# Altium schematic sheet Potentiometers.SchDoc
size A4
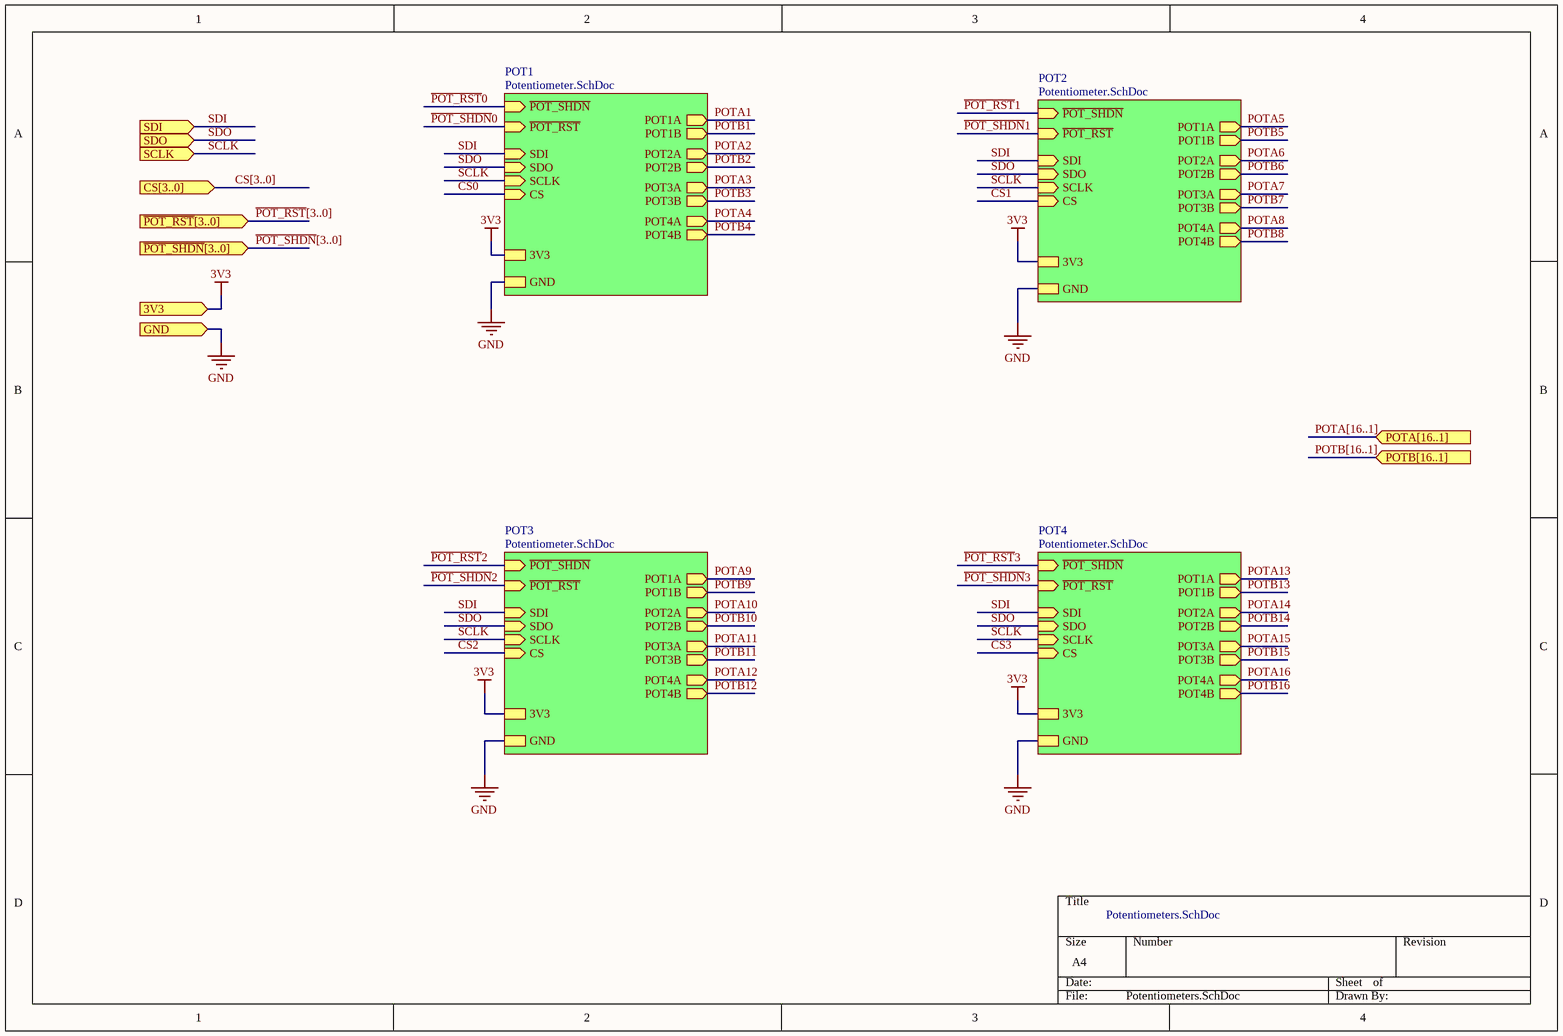
[diagram p0: Potentiometers.SchDoc]

## Sub-sheets
POT1 = Potentiometer.SchDoc: SDI (in), SCLK (in), CS (in), POT1A (out), POT1B (out), POT2A (out), POT2B (out), POT3A (out), POT3B (out), POT4A (out), POT4B (out), 3V3, GND, ~{POT_RST} (in), SDO (in), ~{POT_SHDN} (in)
POT2 = Potentiometer.SchDoc: SDI (in), SCLK (in), CS (in), POT1A (out), POT1B (out), POT2A (out), POT2B (out), POT3A (out), POT3B (out), POT4A (out), POT4B (out), 3V3, GND, ~{POT_RST} (in), SDO (in), ~{POT_SHDN} (in)
POT3 = Potentiometer.SchDoc: SDI (in), SCLK (in), CS (in), POT1A (out), POT1B (out), POT2A (out), POT2B (out), POT3A (out), POT3B (out), POT4A (out), POT4B (out), 3V3, GND, ~{POT_RST} (in), SDO (in), ~{POT_SHDN} (in)
POT4 = Potentiometer.SchDoc: SDI (in), SCLK (in), CS (in), POT1A (out), POT1B (out), POT2A (out), POT2B (out), POT3A (out), POT3B (out), POT4A (out), POT4B (out), 3V3, GND, ~{POT_RST} (in), SDO (in), ~{POT_SHDN} (in)

## Ports
3V3, CS[3..0] (in), GND, POTA[16..1] (in), POTB[16..1] (in), SCLK (in), SDI (in), SDO (in), ~{POT_RST}[3..0] (in), ~{POT_SHDN}[3..0] (in)

## Nets
3V3: port 3V3, sheet POT1/3V3, sheet POT2/3V3, sheet POT3/3V3, sheet POT4/3V3
GND: port GND, sheet POT1/GND, sheet POT2/GND, sheet POT3/GND, sheet POT4/GND
CS0: sheet POT1/CS
CS1: sheet POT2/CS
CS2: sheet POT3/CS
CS3: sheet POT4/CS
~{POT_RST}0: sheet POT1/~{POT_SHDN}
~{POT_RST}1: sheet POT2/~{POT_SHDN}
~{POT_RST}2: sheet POT3/~{POT_SHDN}
~{POT_RST}3: sheet POT4/~{POT_SHDN}
~{POT_SHDN}0: sheet POT1/~{POT_RST}
~{POT_SHDN}1: sheet POT2/~{POT_RST}
~{POT_SHDN}2: sheet POT3/~{POT_RST}
~{POT_SHDN}3: sheet POT4/~{POT_RST}
POTA1: sheet POT1/POT1A
POTA2: sheet POT1/POT2A
POTA3: sheet POT1/POT3A
POTA4: sheet POT1/POT4A
POTA5: sheet POT2/POT1A
POTA6: sheet POT2/POT2A
POTA7: sheet POT2/POT3A
POTA8: sheet POT2/POT4A
POTA9: sheet POT3/POT1A
POTA10: sheet POT3/POT2A
POTA11: sheet POT3/POT3A
POTA12: sheet POT3/POT4A
POTA13: sheet POT4/POT1A
POTA14: sheet POT4/POT2A
POTA15: sheet POT4/POT3A
POTA16: sheet POT4/POT4A
POTB1: sheet POT1/POT1B
POTB2: sheet POT1/POT2B
POTB3: sheet POT1/POT3B
POTB4: sheet POT1/POT4B
POTB5: sheet POT2/POT1B
POTB6: sheet POT2/POT2B
POTB7: sheet POT2/POT3B
POTB8: sheet POT2/POT4B
POTB9: sheet POT3/POT1B
POTB10: sheet POT3/POT2B
POTB11: sheet POT3/POT3B
POTB12: sheet POT3/POT4B
POTB13: sheet POT4/POT1B
POTB14: sheet POT4/POT2B
POTB15: sheet POT4/POT3B
POTB16: sheet POT4/POT4B
SCLK: port SCLK, sheet POT1/SCLK, sheet POT2/SCLK, sheet POT3/SCLK, sheet POT4/SCLK
SDI: port SDI, sheet POT1/SDI, sheet POT2/SDI, sheet POT3/SDI, sheet POT4/SDI
SDO: port SDO, sheet POT1/SDO, sheet POT2/SDO, sheet POT3/SDO, sheet POT4/SDO

## Buses and harness runs
bus CS[3..0] = port CS[3..0]
bus POTA[16..1] = port POTA[16..1]
bus POTB[16..1] = port POTB[16..1]
bus ~{POT_RST}[3..0] = port ~{POT_RST}[3..0]
bus ~{POT_SHDN}[3..0] = port ~{POT_SHDN}[3..0]